# EAGLE design level_shifter2-doh (EAGLE 5.07)
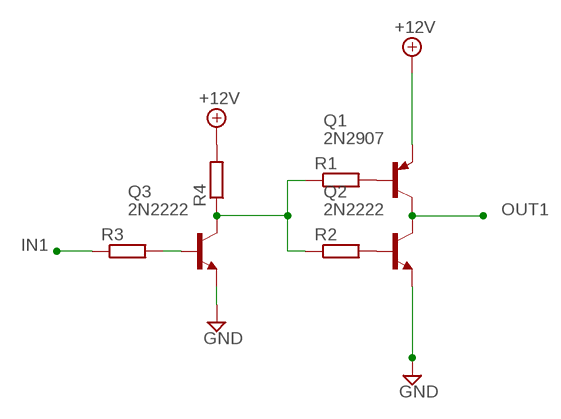
[diagram p0: schematic, sheet 1]

## Parts
Q1  2N2907  [TO18]
Q2  2N2222  [TO18]
Q3  2N2222  [TO18]
R1  R-EU_0204/5  [0204/5]
R2  R-EU_0204/5  [0204/5]
R3  R-EU_0204/5  [0204/5]
R4  R-EU_0204/5  [0204/5]

## Nets
+12V: Q1.1(E) R4.2
GND: Q2.1(E) Q3.1(E)
IN1: R3.1
N$3: Q2.2(B) R2.2
N$4: Q1.2(B) R1.2
N$8: Q3.3(C) R1.1 R2.1 R4.1
N$10: Q3.2(B) R3.2
OUT1: Q1.3(C) Q2.3(C)

## Library data of the parts
Q1 = transistor-pnp:2N2907*: PNP Transistor
Q2 Q3 = transistor-npn:2N2222*: NPN Transistor
R1-R4 = rcl:R-EU_: RESISTOR, European symbol

## Board
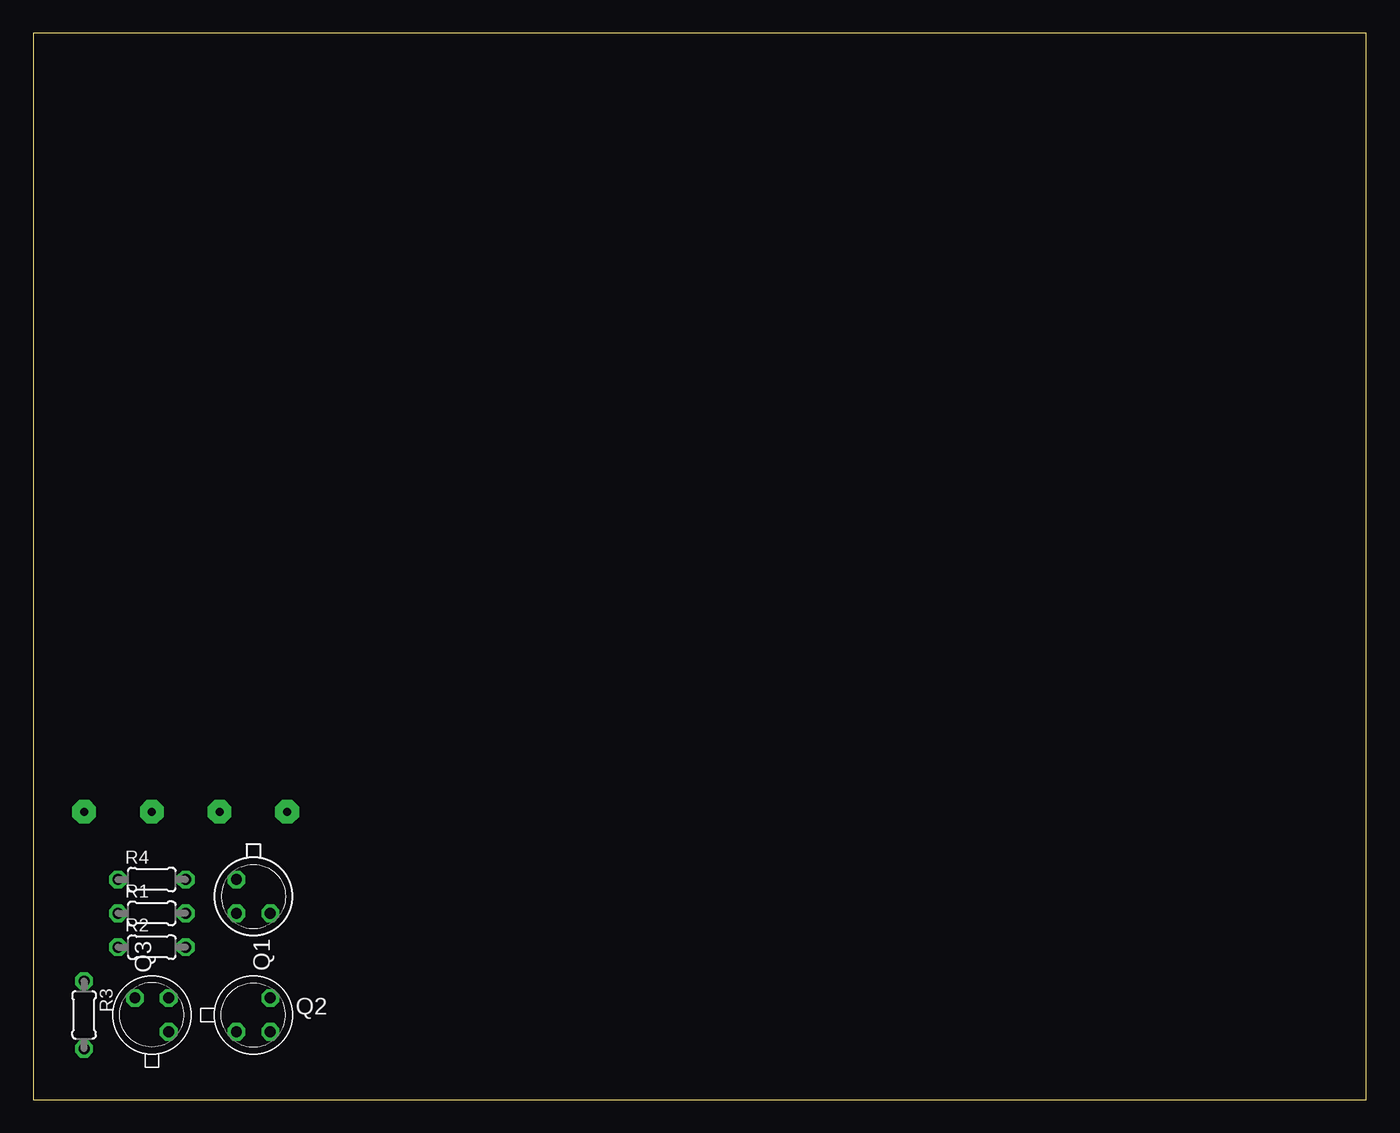
[diagram p1: board, top side]
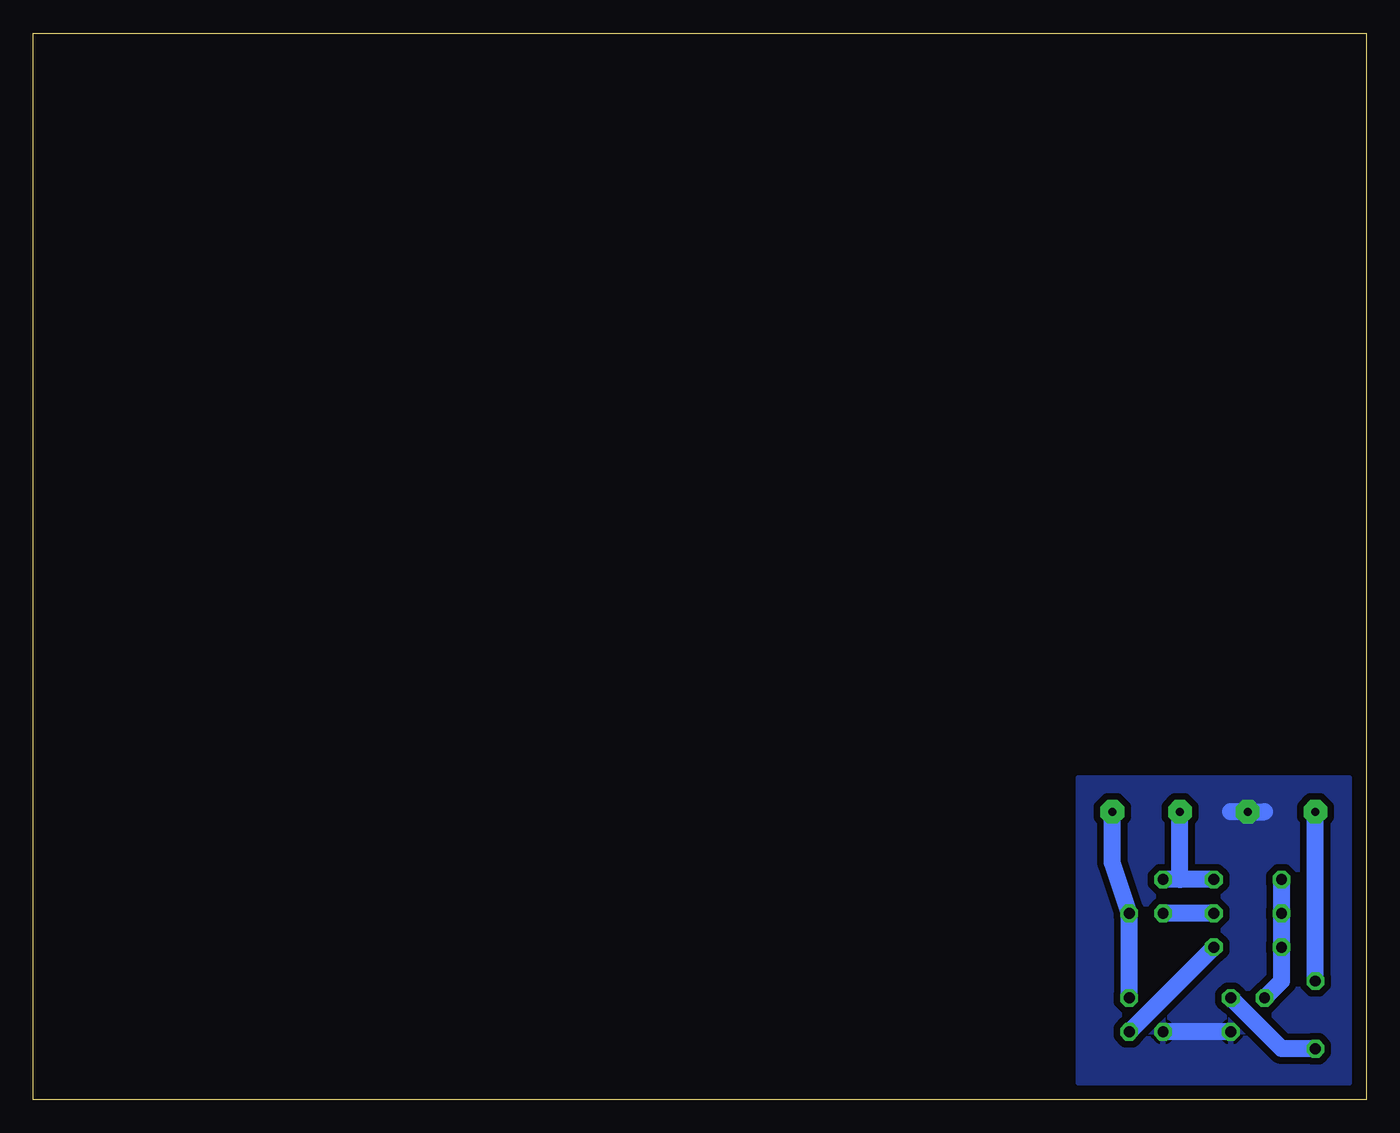
[diagram p2: board, bottom side, seen from below]

Size 100 x 80 mm. Coordinates in mm from the lower left corner, seen from the top.
Outline: 0,0 100,0 100,80 0,80 0,0
Copper layers (1*16): Top 0.035mm / dielectric 1.5mm / Bottom 0.035mm
Design rules "default *": minimum track width 10mil, minimum drill 24mil, track to track 20mil, track to pad 20mil, pad to pad 8mil, via to via 8mil, smd to smd 8mil, copper to edge 40mil, drill to drill 8mil, minimum pad ring 10mil, minimum via ring 8mil, stop-mask expansion 4mil, vias tented up to drill 0mil, thermal gap 10mil

### Footprints (pad centres in the part's own frame; a part is rotated, then mirrored left to right if it is on the bottom)
TO18 = drill 0.813 octagon: 1 -1.27,-1.27; 2 1.27,-1.27; 3 1.27,1.27
0204/5 = drill 0.813 octagon: 1 -2.54,0; 2 2.54,0

### Placement (x,y rotation side)
Q1  16.51,15.24 270 top
Q2  16.51,6.35 0 top
Q3  8.89,6.35 90 top
R1  8.89,13.97 0 top
R2  8.89,11.43 0 top
R3  3.81,6.35 270 top
R4  8.89,16.51 0 top

### Tracks (layer width: path | path; a pad name or v marks a point on that pad's centre or on a via)
+12V  (via drill 0.6 pad 1.78)
  Bottom 1.27: R4.2 13.97,16.51 | 13.97,16.51 Q1.1 | 13.97,16.51 v13.97,21.59
GND  (via drill 0.6 pad 1.78)
  Bottom 1.27: Q3.1 Q2.1 | 7.62,21.59 v8.89,21.59 10.16,21.59
  pour Bottom: 1.27,24.13 21.59,24.13 21.59,1.27 1.27,1.27
IN1  (via drill 0.6 pad 1.78)
  Bottom 1.27: R3.1 v3.81,21.59
N$3
  Bottom 1.27: R2.2 Q2.2
N$4
  Bottom 1.27: R1.2 Q1.2
N$8
  Bottom 1.27: R4.1 R1.1 R2.1 6.35,8.89 Q3.3
N$10
  Bottom 1.27: R3.2 6.35,3.81 Q3.2
OUT1  (via drill 0.6 pad 1.78)
  Bottom 1.27: Q2.3 Q1.3 19.05,17.78 v19.05,21.59